# Altium schematic sheet 3_POWER.schdoc
size 307 x 218 mm; Symbol: Drawing-Symbol_A4; Device: Drawing-Symbol_A4; Company: 嘉立创EDA; Version: V1.0; Page Size: A4; @Project Name: 工程文件; @Page Count: 7; @Update Date: 2025-06-16; @Create Date: 2025-06-12; @Schematic Name: Schematic1; @Page No: 3; @Page Name: POWER; @Create Time: 02:21:35; @Update Time: 17:10:51; Width: 1170; Height: 825; Region Start: 1; X Region Count: 6; Y Region Count: 4; Blade Width: 10; Title Block Position: 3; @Board Name: Board1
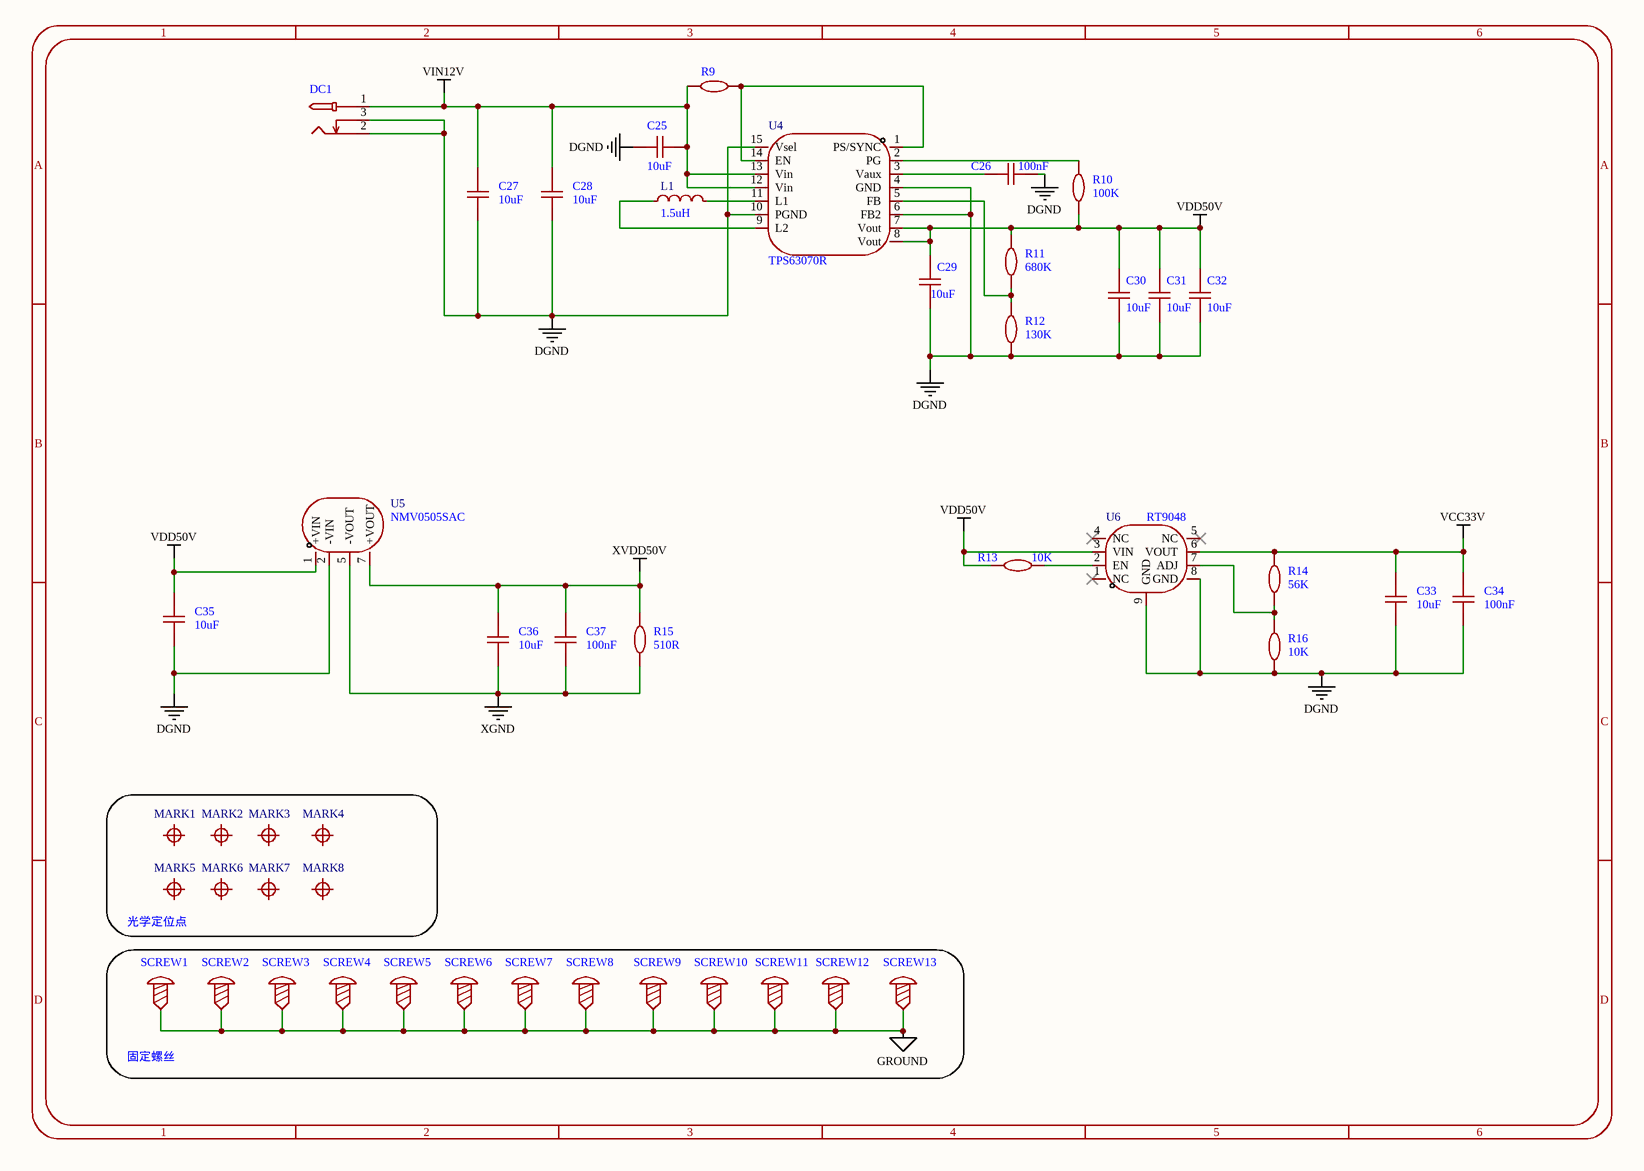
[diagram p0: 3_POWER.schdoc]

## Parts
C25  10uF  [C0603]
C26  100nF  [C0603]
C27  10uF  [C0805]
C28  10uF  [C0805]
C29  10uF  [C0603]
C30  10uF  [C0805]
C31  10uF  [C0805]
C32  10uF  [C0805]
C33  10uF  [C0603]
C34  100nF  [C0402]
C35  10uF  [C0603]
C36  10uF  [C0603]
C37  100nF  [C0402]
DC1  (no value)  [DC-005_2.5]
L1  1.5uH  [IND-SMD_L4.0-W4.0_FNR40XXS]
MARK1  (no value)  [Mark-Point-1mm]
MARK2  (no value)  [Mark-Point-1mm]
MARK3  (no value)  [Mark-Point-1mm]
MARK4  (no value)  [Mark-Point-1mm]
MARK5  (no value)  [Mark-Point-1mm]
MARK6  (no value)  [Mark-Point-1mm]
MARK7  (no value)  [Mark-Point-1mm]
MARK8  (no value)  [Mark-Point-1mm]
R9  10K  [R0603]  (value not drawn)
R10  100K  [R0603]
R11  680K  [R0603]
R12  130K  [R0603]
R13  10K  [R0402]
R14  56K  [R0402]
R15  510R  [R1206]
R16  10K  [R0402]
SCREW1  (no value)  [M3]
SCREW2  (no value)  [M3]
SCREW3  (no value)  [M3]
SCREW4  (no value)  [M3]
SCREW5  (no value)  [M3]
SCREW6  (no value)  [M3]
SCREW7  (no value)  [M3]
SCREW8  (no value)  [M3]
SCREW9  (no value)  [M3]
SCREW10  (no value)  [M3]
SCREW11  (no value)  [M3]
SCREW12  (no value)  [M3]
SCREW13  (no value)  [M3]
U4  TPS63070R  [VQFN-HR-15_L3.0-W2.5-P0.50-BL_TPS63070RNMR]
U5  NMV0505SAC  [PWRM-TH_4P-L19.5-W6.0-P2.54_NMV0505SAC]
U6  RT9048  [ESOP-8_L4.9-W3.9-P1.27-LS6.0-BL-EP]

## Blocks framed on the sheet
光学定位点: MARK1-MARK8
固定螺丝: SCREW1-SCREW13

## Nets
DGND: C25.2 C26.2 C27.1 C28.1 C29.1 C30.2 C31.2 C32.2 C33.1 C34.1 C35.1 DC1.2 DC1.3 R12.2 R16.2 U4.4(GND) U4.6(FB2) U4.10(PGND) U4.15(Vsel) U5.2(-VIN) U6.8(GND) U6.9(GND)
GROUND: SCREW1.1 SCREW2.1 SCREW3.1 SCREW4.1 SCREW5.1 SCREW6.1 SCREW7.1 SCREW8.1 SCREW9.1 SCREW10.1 SCREW11.1 SCREW12.1 SCREW13.1
VCC33V: C33.2 C34.2 R14.1 U6.6(VOUT)
VDD50V: C29.2 C30.1 C31.1 C32.1 C35.2 R10.2 R11.1 R13.1 U4.7(Vout) U4.8(Vout) U5.1(+VIN) U6.3(VIN)
VIN12V: C25.1 C27.2 C28.2 DC1.1 R9.2 U4.12(Vin) U4.13(Vin)
XGND: C36.1 C37.1 R15.1 U5.5(-VOUT)
XVDD50V: C36.2 C37.2 R15.2 U5.7(+VOUT)
NetC26_1: C26.1 U4.3(Vaux)
NetL1_1: L1.1 U4.9(L2)
NetL1_2: L1.2 U4.11(L1)
NetR9_1: R9.1 U4.1(PS/SYNC) U4.14(EN)
NetR10_1: R10.1 U4.2(PG)
NetR11_2: R11.2 R12.1 U4.5(FB)
NetR13_2: R13.2 U6.2(EN)
NetR14_2: R14.2 R16.1 U6.7(ADJ)

Not connected (* = marked no-connect by the designer): MARK1 1; MARK2 1; MARK3 1; MARK4 1; MARK5 1; MARK6 1; MARK7 1; MARK8 1; U6 1(NC)* 4(NC)* 5(NC)*

## Notes on the sheet
- 1
- 2
- 3
- 4
- 5
- 6
- A
- B
- C
- D

## Library data of the parts
C25 C26 C29 C33 C35 C36 = CAP_0603: Symbol: CapAcitance; Convert to PCB: yes; Device: CAP_0603; Add into BOM: yes
  C25 C29 C33 C35 C36: Value: 10uF
  C26: Value: 100nF
C27 C28 C30-C32 = CAP_0805: Symbol: CapAcitance; Convert to PCB: yes; Device: CAP_0805; Add into BOM: yes; Value: 10uF
C34 C37 = CAP_0402: Symbol: CapAcitance; Convert to PCB: yes; Device: CAP_0402; Add into BOM: yes; Value: 100nF
DC1 = DC-005_2.5: Convert to PCB: yes; Symbol: DC-005_2.5; Device: DC-005_2.5; Add into BOM: yes
L1 = FNR4020S1R5MT: Add into BOM: yes; Tolerance: ±20%; Symbol: FNR4020S1R5MT; Device: FNR4020S1R5MT; Convert to PCB: yes; Value: 1.5uH
MARK1-MARK8 = Mark-Point: Add into BOM: no; Convert to PCB: yes; Symbol: Mark-Point; Device: Mark-Point
R9-R12 = Res_0603: Symbol: 电阻; Convert to PCB: yes; Device: Res_0603; Add into BOM: yes
  R9: Value: 10K
  R10: Value: 100K
  R11: Value: 680K
  R12: Value: 130K
R13 R14 R16 = Res_0402: Symbol: 电阻; Convert to PCB: yes; Device: Res_0402; Add into BOM: yes
  R13 R16: Value: 10K
  R14: Value: 56K
R15 = Res_1206: Symbol: 电阻; Add into BOM: yes; Device: Res_1206; Convert to PCB: yes; Value: 510R
SCREW1-SCREW13 = M3螺丝: Symbol: 螺丝孔; Convert to PCB: yes; Device: M3螺丝; Add into BOM: yes; Supplier Footprint: 插件
U4 = TPS63070RNMR: Add into BOM: yes; Symbol: TPS63070RNMR; Device: TPS63070RNMR; Manufacturer Part: TPS63070R; Convert to PCB: yes; Output Current: -
U5 = NMV0505SAC: Add into BOM: yes; Symbol: NMV0505SAC; Device: NMV0505SAC; Manufacturer Part: NMV0505SAC; Convert to PCB: yes
U6 = RT9048GSP: Add into BOM: yes; Symbol: RT9048GSP; Device: RT9048GSP; Manufacturer Part: RT9048; Convert to PCB: yes